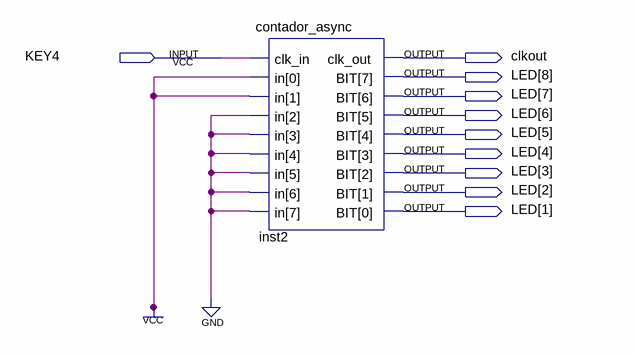
[diagram p0: schematic sheet]
// Quartus schematic contador_teste_numeros.bdf as structural Verilog: 1 symbols, 10 pins
module contador_teste_numeros (
  input  KEY4,
  output clkout,
  output [8:1] LED
);

  contador_async inst2 (.clk_in(KEY4), .in(8'b00000011), .clk_out(clkout), .BIT(LED));
endmodule
